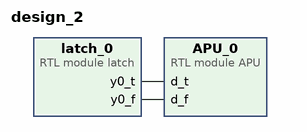
[diagram p0: block diagram of the top level]
# Vivado block design design_2, xc7a35tcpg236-1, Vivado 2019.2
create_bd_design design_2

create_bd_cell -type module -reference latch latch_0
create_bd_cell -type module -reference APU APU_0

# ---- connections ----

connect_bd_net [get_bd_pins latch_0/y0_t] [get_bd_pins APU_0/d_t]
connect_bd_net [get_bd_pins latch_0/y0_f] [get_bd_pins APU_0/d_f]

validate_bd_design
save_bd_design
